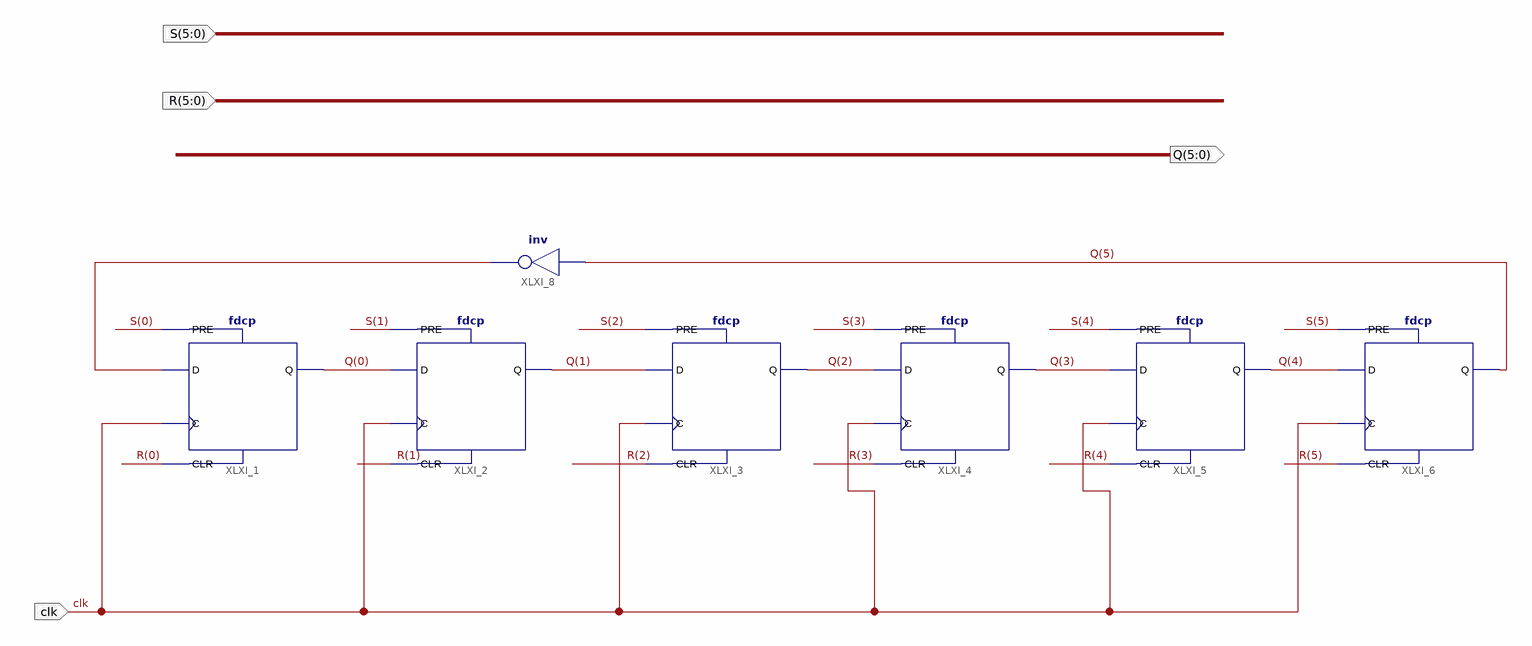
[diagram p0: schematic sheet 1]
// Xilinx ISE schematic jc.sch (virtex4) as structural Verilog: 7 symbols, 4 ports
module jc (
  input  [5:0] S,
  input  [5:0] R,
  input  clk,
  output [5:0] Q
);

  wire XLXN_25;

  fdcp XLXI_1 (.C(clk), .CLR(R[0]), .D(XLXN_25), .PRE(S[0]), .Q(Q[0]));
  fdcp XLXI_2 (.C(clk), .CLR(R[1]), .D(Q[0]), .PRE(S[1]), .Q(Q[1]));
  fdcp XLXI_3 (.C(clk), .CLR(R[2]), .D(Q[1]), .PRE(S[2]), .Q(Q[2]));
  fdcp XLXI_4 (.C(clk), .CLR(R[3]), .D(Q[2]), .PRE(S[3]), .Q(Q[3]));
  fdcp XLXI_5 (.C(clk), .CLR(R[4]), .D(Q[3]), .PRE(S[4]), .Q(Q[4]));
  fdcp XLXI_6 (.C(clk), .CLR(R[5]), .D(Q[4]), .PRE(S[5]), .Q(Q[5]));
  not XLXI_8 (XLXN_25, Q[5]);
endmodule
